# Altium project IndoorPositioning.PrjPcb
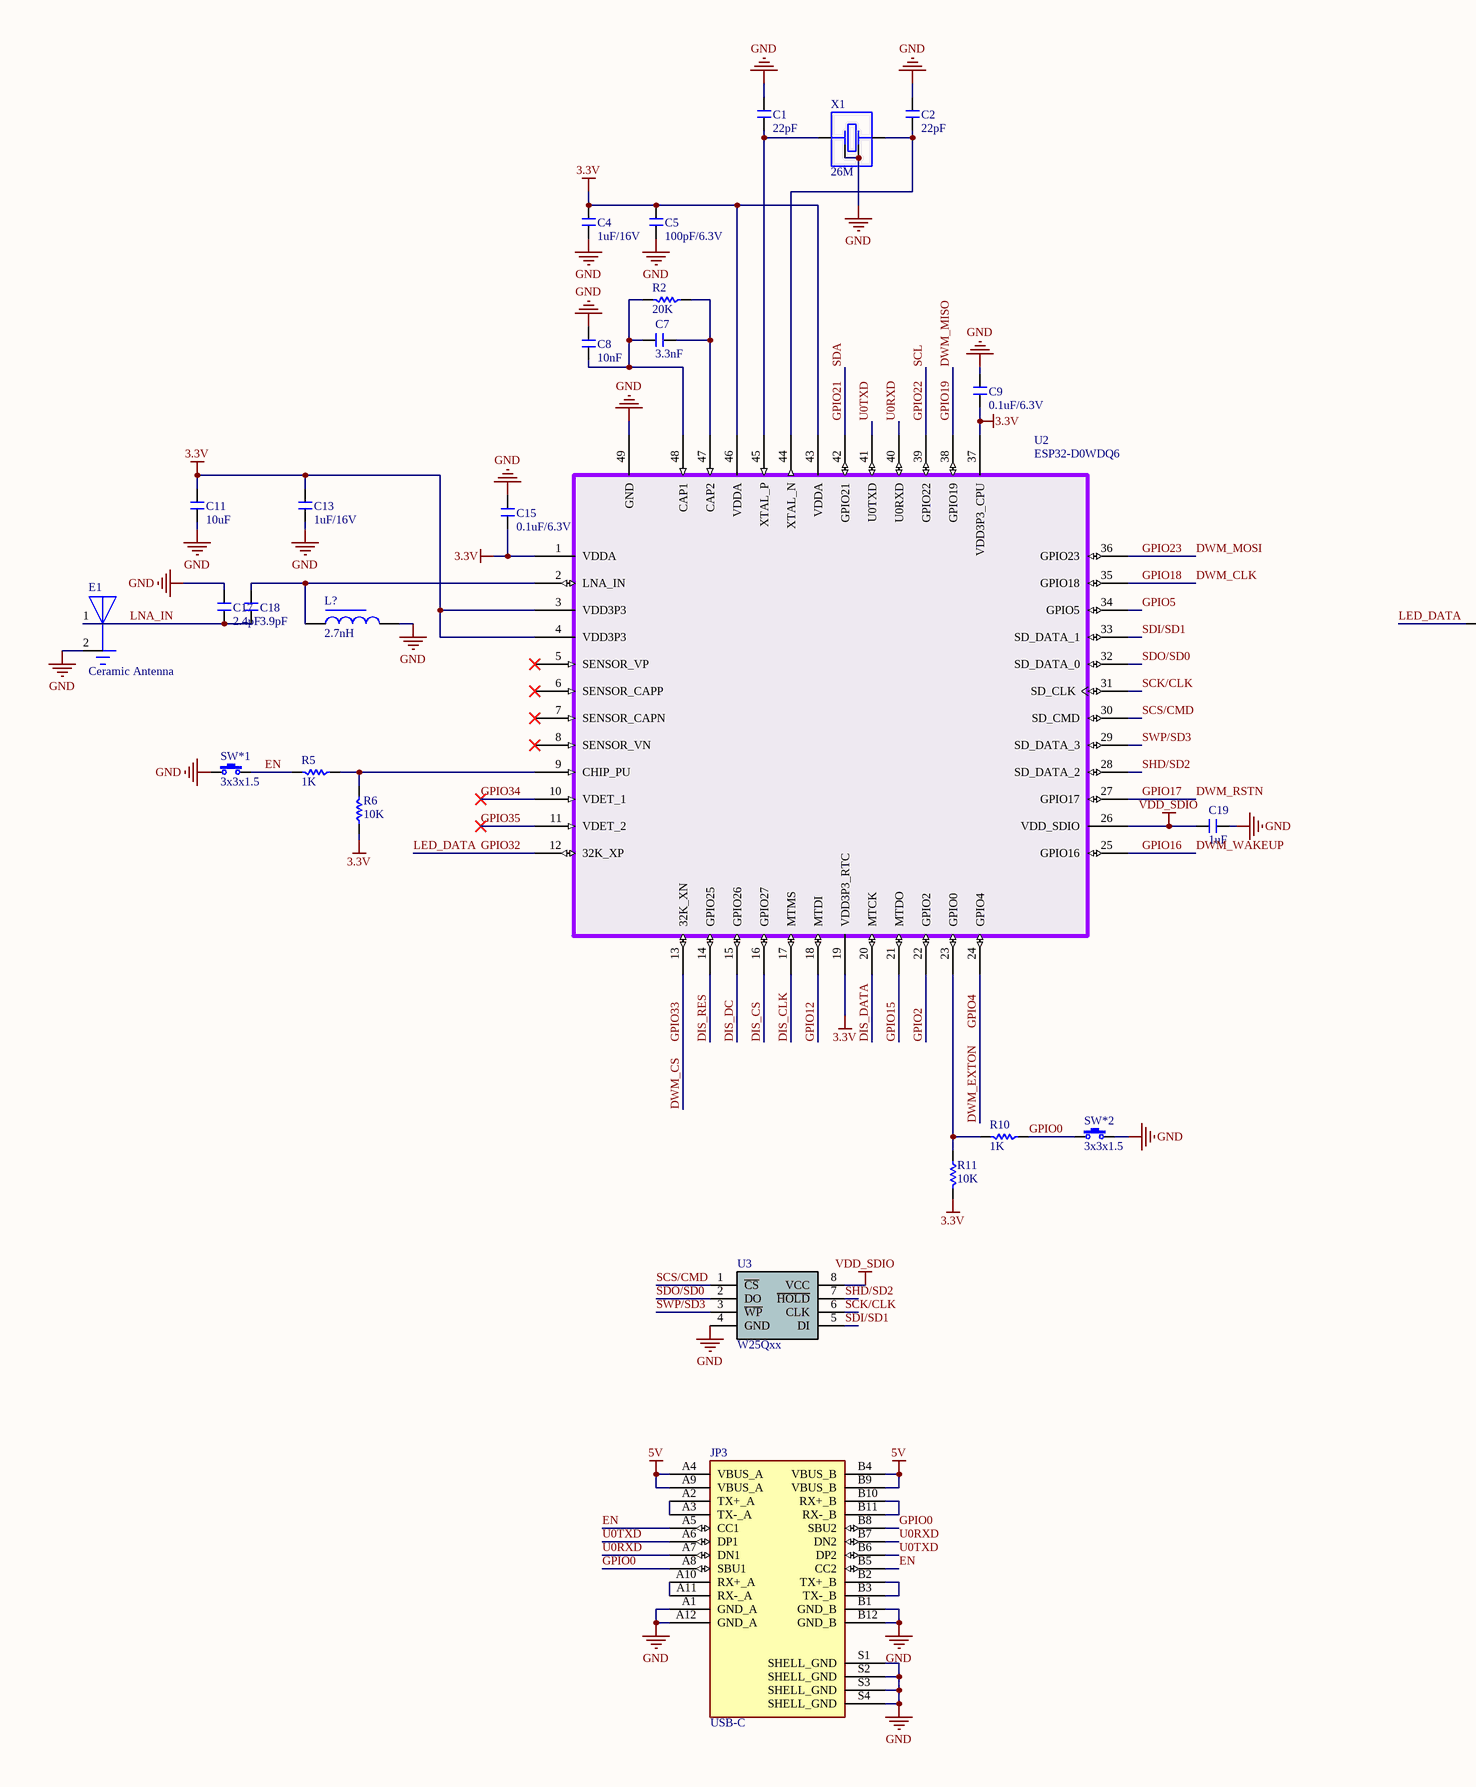
[diagram p0: Main.SchDoc, left]
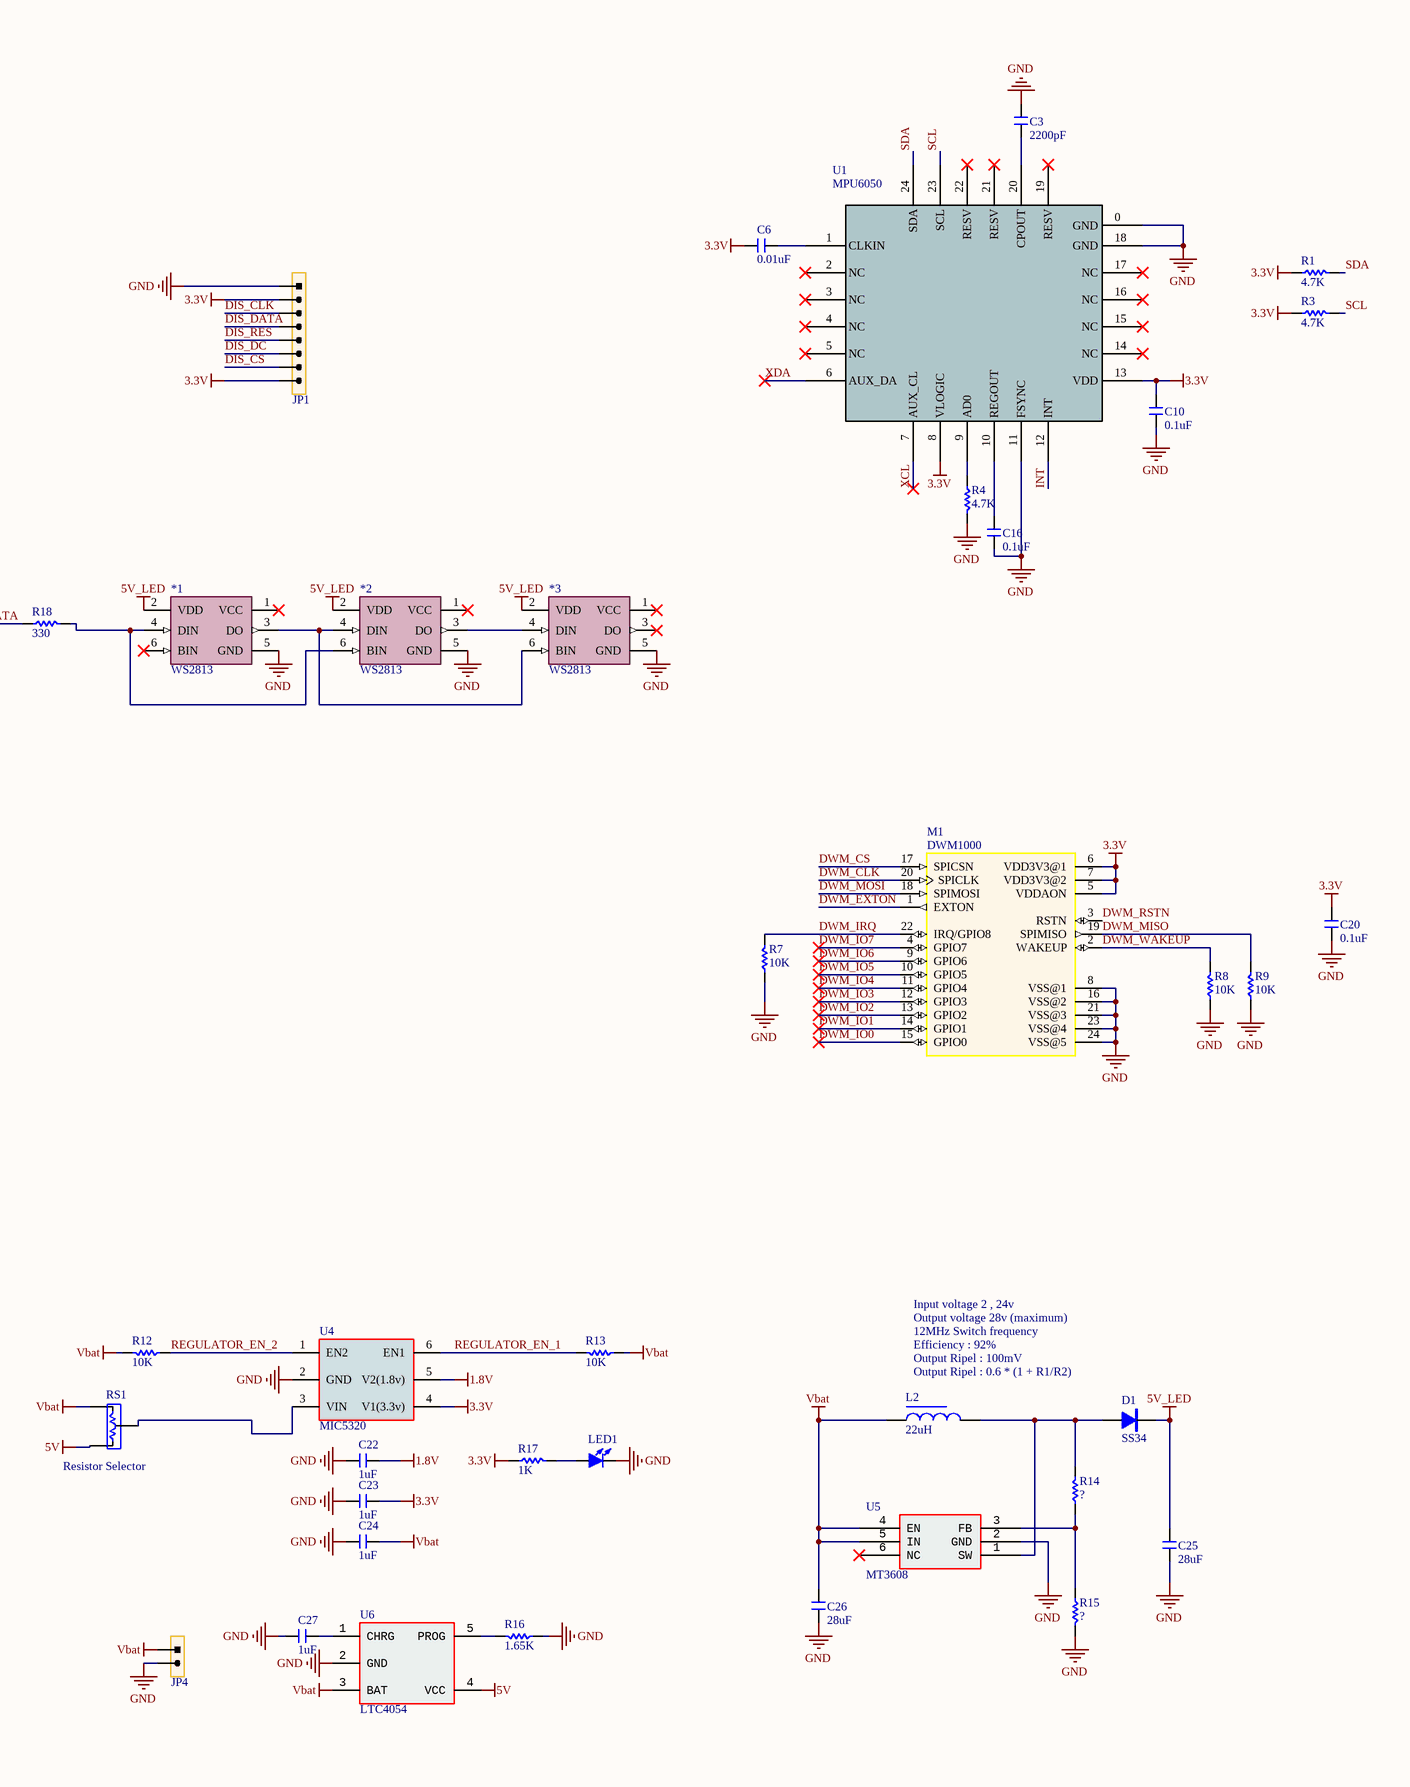
[diagram p1: Main.SchDoc, right]
1 sheet, 64 parts. Net scope: global (net labels, ports and power ports of the same name join across sheets).
Board file: IndoorPositioning PCB.PcbDoc

## Sheet Main.SchDoc
size A2; SheetNumber: 1; SheetTotal: 1

### Parts
*1  WS2813  [WS2813]
*2  WS2813  [WS2813]
*3  WS2813  [WS2813]
C1  22pF  [C 0603]
C2  22pF  [C 0603]
C3  2200pF  [C 0603]
C4  1uF/16V  [C 0603]
C5  100pF/6.3V  [C 0603]
C6  0.01uF  [C 0603]
C7  3.3nF  [C 0603]
C8  10nF  [C 0603]
C9  0.1uF/6.3V  [C 0603]
C10  0.1uF  [C 0603]
C11  10uF  [C 0603]
C13  1uF/16V  [C 0603]
C15  0.1uF/6.3V  [C 0603]
C16  0.1uF  [C 0603]
C17  2.4pF  [C 0603]
C18  3.9pF  [C 0603]
C19  1uF  [C 0603]
C20  0.1uF  [C 0805]
C22  1uF  [C 0603]
C23  1uF  [C 0603]
C24  1uF  [C 0603]
C25  28uF  [C 0603]
C26  28uF  [C 0603]
C27  1uF  [C 0603]
D1  SS34  [SMA]
E1  Ceramic Antenna  [Ceramic_2.4]
JP1  HDR-1X8  [HDR-1X8_M]  (value not drawn)
JP3  USB-C  [USB-C-RIGHT]
JP4  HDR-1X2  [PH2.0-2P_H]  (value not drawn)
L2  22uH  [L 1206]
L?  2.7nH  [L 0603]
LED1  LED-SMD  [LED 0603R]  (value not drawn)
M1  DWM1000  [DWM1000]
R1  4.7K  [R 0603-HP]
R2  20K  [R 0603-HP]
R3  4.7K  [R 0603-HP]
R4  4.7K  [R 0603-HP]
R5  1K  [R 0603-HP]
R6  10K  [R 0603-HP]
R7  10K  [R 0805-HP]
R8  10K  [R 0805-HP]
R9  10K  [R 0805-HP]
R10  1K  [R 0603-HP]
R11  10K  [R 0603-HP]
R12  10K  [R 0603-HP]
R13  10K  [R 0603-HP]
R14  ?  [R 0603-HP]
R15  ?  [R 0603-HP]
R16  1.65K  [R 0603-HP]
R17  1K  [R 0603-HP]
R18  330  [R 0603-HP]
RS1  Resistor Selector  [RS 0603]
SW*1  3x3x1.5  [TSW SMD-3*3]
SW*2  3x3x1.5  [TSW SMD-3*3]
U1  MPU6050  [QFN24]
U2  ESP32-D0WDQ6  [ESP32-D0WDQ6]
U3  W25Qxx  [SOP8W_N]
U4  MIC5320  [SOT23-6L]
U5  MT3608  [SOT23-6N]
U6  LTC4054  [SOT25-5L]
X1  26M  [XTAL-2520-4]

### Nets
1.8V: C22.2 U4.5(V2(1.8v))
3.3V: C4.1 C5.1 C6.2 C9.1 C10.1 C11.2 C13.2 C15.1 C20.1 C23.1 JP1.2 JP1.8 M1.5(VDDAON) M1.6(VDD3V3@1) M1.7(VDD3V3@2) R1.1 R3.1 R6.1 R11.2 R17.1 U1.8(VLOGIC) U1.13(VDD) U2.1(VDDA) U2.3(VDD3P3) U2.4(VDD3P3) U2.19(VDD3P3_RTC) U2.37(VDD3P3_CPU) U2.43(VDDA) U2.46(VDDA) U4.4(V1(3.3v))
5V: JP3.A4(VBUS_A) JP3.A9(VBUS_A) JP3.B4(VBUS_B) JP3.B9(VBUS_B) RS1.1 U6.4(VCC)
5V_LED: *1.2(VDD) *2.2(VDD) *3.2(VDD) C25.1 D1.2(K)
GND: *1.5(GND) *2.5(GND) *3.5(GND) C1.2 C2.2 C3.2 C4.2 C5.2 C8.2 C9.2 C10.2 C11.1 C13.1 C15.2 C16.2 C17.1 C19.2 C20.2 C22.1 C23.2 C24.1 C25.2 C26.2 C27.1 E1.2 JP1.1 JP3.A1(GND_A) JP3.A12(GND_A) JP3.B1(GND_B) JP3.B12(GND_B) JP3.S1(SHELL_GND) JP3.S2(SHELL_GND) JP3.S3(SHELL_GND) JP3.S4(SHELL_GND) JP4.2 L?.2 LED1.2(K) M1.8(VSS@1) M1.16(VSS@2) M1.21(VSS@3) M1.23(VSS@4) M1.24(VSS@5) R4.2 R7.1 R8.1 R9.1 R15.2 R16.1 SW*1.1 SW*2.2 U1.0(GND) U1.11(FSYNC) U1.18(GND) U2.49(GND) U3.4(GND) U4.2(GND) U5.2(GND) U6.2(GND) X1.2 X1.4
Vbat: C24.2 C26.1 JP4.1 L2.1 R12.2 R13.1 RS1.2 U5.4(EN) U5.5(IN) U6.3(BAT)
VDD_SDIO: C19.1 U2.26(VDD_SDIO) U3.8(VCC)
DIS_CLK: JP1.3 U2.17(MTMS)
DIS_CS: JP1.7 U2.16(GPIO27)
DIS_DATA: JP1.4 U2.20(MTCK)
DIS_DC: JP1.6 U2.15(GPIO26)
DIS_RES: JP1.5 U2.14(GPIO25)
DWM_CLK: M1.20(SPICLK) U2.35(GPIO18)  [also labelled GPIO18]
DWM_CS: M1.17(SPICSN) U2.13(32K_XN)  [also labelled GPIO33]
DWM_EXTON: M1.1(EXTON) U2.24(GPIO4)  [also labelled GPIO4]
DWM_IO0: M1.15(GPIO0)
DWM_IO1: M1.14(GPIO1)
DWM_IO2: M1.13(GPIO2)
DWM_IO3: M1.12(GPIO3)
DWM_IO4: M1.11(GPIO4)
DWM_IO5: M1.10(GPIO5)
DWM_IO6: M1.9(GPIO6)
DWM_IO7: M1.4(GPIO7)
DWM_IRQ: M1.22(IRQ/GPIO8) R7.2
DWM_MISO: M1.19(SPIMISO) R9.2 U2.38(GPIO19)  [also labelled GPIO19]
DWM_MOSI: M1.18(SPIMOSI) U2.36(GPIO23)  [also labelled GPIO23]
DWM_RSTN: M1.3(RSTN) U2.27(GPIO17)  [also labelled GPIO17]
DWM_WAKEUP: M1.2(WAKEUP) R8.2 U2.25(GPIO16)  [also labelled GPIO16]
EN: JP3.A5(CC1) JP3.B5(CC2) R5.2 SW*1.2
GPIO0: JP3.A8(SBU1) JP3.B8(SBU2) R10.1 SW*2.1
GPIO2: U2.22(GPIO2)
GPIO5: U2.34(GPIO5)
GPIO12: U2.18(MTDI)
GPIO15: U2.21(MTDO)
GPIO21: R1.2 U1.24(SDA) U2.42(GPIO21)  [also labelled SDA]
GPIO22: R3.2 U1.23(SCL) U2.39(GPIO22)  [also labelled SCL]
GPIO32: R18.1 U2.12(32K_XP)  [also labelled LED_DATA]
GPIO34: U2.10(VDET_1)
GPIO35: U2.11(VDET_2)
INT: U1.12(INT)
LNA_IN: C17.2 C18.2 E1.1
REGULATOR_EN_1: R13.2 U4.6(EN1)
REGULATOR_EN_2: R12.1 U4.1(EN2)
SCK/CLK: U2.31(SD_CLK) U3.6(CLK)
SCS/CMD: U2.30(SD_CMD) U3.1(~{CS})
SDI/SD1: U2.33(SD_DATA_1) U3.5(DI)
SDO/SD0: U2.32(SD_DATA_0) U3.2(DO)
SHD/SD2: U2.28(SD_DATA_2) U3.7(~{HOLD})
SWP/SD3: U2.29(SD_DATA_3) U3.3(~{WP})
U0RXD: JP3.A7(DN1) JP3.B7(DN2) U2.40(U0RXD)
U0TXD: JP3.A6(DP1) JP3.B6(DP2) U2.41(U0TXD)
XCL: U1.7(AUX_CL)
XDA: U1.6(AUX_DA)
Net*1_3: *1.3(DO) *2.4(DIN) *3.6(BIN)
Net*1_4: *1.4(DIN) *2.6(BIN) R18.2
Net*2_3: *2.3(DO) *3.4(DIN)
NetC1_1: C1.1 U2.45(XTAL_P) X1.1
NetC2_1: C2.1 U2.44(XTAL_N) X1.3
NetC3_1: C3.1 U1.20(CPOUT)
NetC6_1: C6.1 U1.1(CLKIN)
NetC7_1: C7.1 C8.1 R2.2 U2.48(CAP1)
NetC7_2: C7.2 R2.1 U2.47(CAP2)
NetC16_1: C16.1 U1.10(REGOUT)
NetC18_1: C18.1 L?.1 U2.2(LNA_IN)
NetC27_2: C27.2 U6.1(CHRG)
NetD1_1: D1.1(A) L2.2 R14.2 U5.1(SW)
NetJP3_A2: JP3.A2(TX+_A) JP3.A3(TX-_A)
NetJP3_A10: JP3.A10(RX+_A) JP3.A11(RX-_A)
NetJP3_B2: JP3.B2(TX+_B) JP3.B3(TX-_B)
NetJP3_B10: JP3.B10(RX+_B) JP3.B11(RX-_B)
NetLED1_1: LED1.1(A) R17.2
NetR4_1: R4.1 U1.9(AD0)
NetR5_1: R5.1 R6.2 U2.9(CHIP_PU)
NetR10_2: R10.2 R11.1 U2.23(GPIO0)
NetR14_1: R14.1 R15.1 U5.3(FB)
NetR16_2: R16.2 U6.5(PROG)
NetRS1_3: RS1.3 U4.3(VIN)

Not connected (* = marked no-connect by the designer): *1 1(VCC)* 6(BIN)*; *2 1(VCC)*; *3 1(VCC)* 3(DO)*; U1 2(NC)* 3(NC)* 4(NC)* 5(NC)* 14(NC)* 15(NC)* 16(NC)* 17(NC)* 19(RESV)* 21(RESV)* 22(RESV)*; U2 5(SENSOR_VP)* 6(SENSOR_CAPP)* 7(SENSOR_CAPN)* 8(SENSOR_VN)*; U5 6(NC)*

### Notes on the sheet
- Input voltage 2 , 24v
- Output voltage 28v (maximum)
- 12MHz Switch frequency
- Efficiency : 92%
- Output Ripel : 100mV
- Output Ripel : 0.6 * (1 + R1/R2)

### Library data of the parts
C1-C11 C13 C15-C20 C22-C27 = C: Non-polar patch capacitor; BOM名称: 无极性贴片电容; 版权归属: 源创客; 学习资源: www.ooocke.com
D1 = SS34: Schottky diodes; BOM名称: 肖特基二极管; 版权归属: 源创客; 属性: 40V/3A; 学习资源: www.ooocke.com
JP1 = Header 8: 8P Connector; BOM名称: 8P接插件; 版权归属: 源创客; 学习资源: www.ooocke.com
JP3 = USB-C-RIGHT
JP4 = Header 2: 2P Connector; BOM名称: 2P接插件; 版权归属: 源创客; 学习资源: www.ooocke.com
L2 L? = L: Low power chip inductor; BOM名称: 小功率贴片电感; 版权归属: 源创客; 学习资源: www.ooocke.com
LED1 = LED-SMD: Patch LED; BOM名称: 贴片LED; 版权归属: 源创客; 学习资源: www.ooocke.com
R1-R18 = R: Chip resistor; 版权归属: 源创客; BOM名称: Chip resistor; 学习资源: www.ooocke.com
SW*1 SW*2 = TSW 3x3: 3x3 tact switch
U1 = MPU6050: Six-axis accelerometer
U2 = ESP32-D0WDQ6: IC RF TxRx + MCU Bluetooth, WiFi 802.11b/g/n, Bluetooth 4.2 2.4GHz 48-VFQFN Exposed Pad
U3 = W25Qxx: External flash; BOM名称: 外置Flash; 版权归属: 源创客; 学习资源: www.ooocke.com
U5 = MT3608: 1.2MHz 2A Step Up Converter
U6 = LTC4054: Battery Charger; Type: SOT23-5
X1 = XTAL-4: 4-Pin crystal; BOM名称: 4脚晶振; 版权归属: 源创客; 学习资源: www.ooocke.com